# EasyEDA schematic SCH_New Project4_2022-07-20.json
TITLE: 自平衡方块; REV: 1.0; Date: 2022-07-08; Sheet: 1/1; Drawn By: xiaocainiao233; Company: 寄
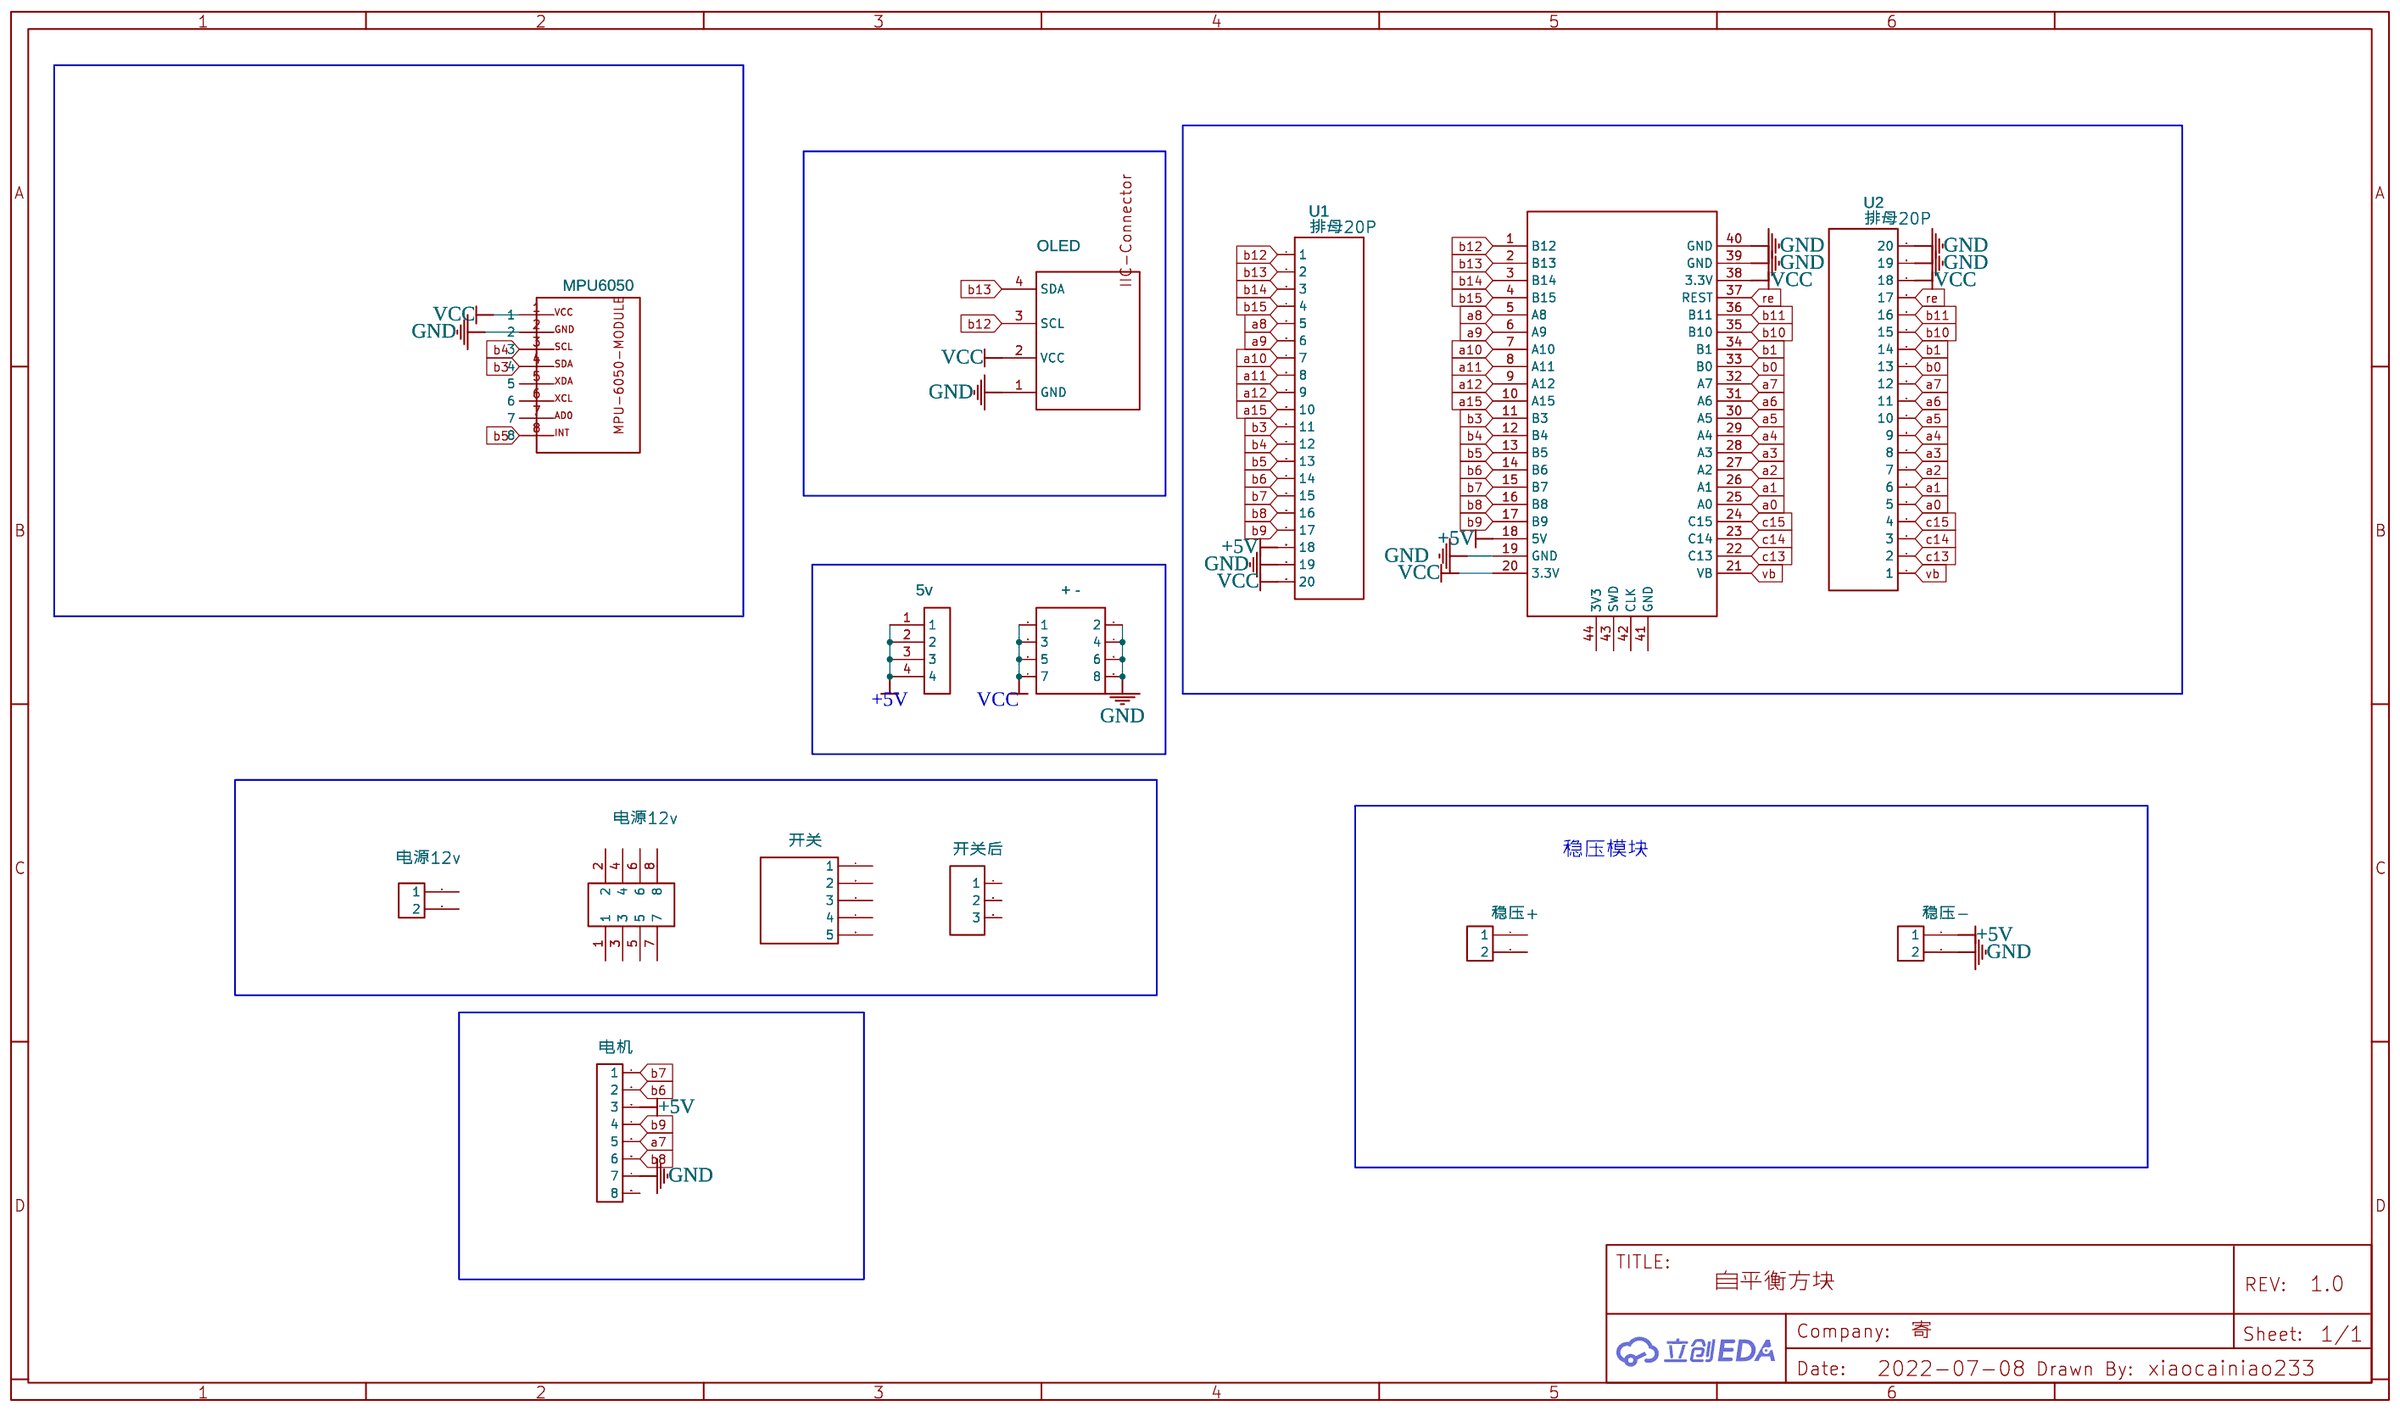
[diagram p0: schematic sheet]

## Parts
AAAAU1  MPU6050  [MPU-6050-MODULE]
ASDFGUUU1  STM32F103C8T6最小系统板  [STM32F103C8T6]
H1  + -  [HDR-TH_8P-P2.54-V-F-R2-C4-S2.54]
H2  5v  [排针排母4P 2.54MM]
H3  电源12v  [排针排母2*4P]
J1  电源12v  [排针排母2P]
J2  开关  [排针排母5P]
J3  电机  [排针排母8P]
J4  稳压+  [排针排母2P]
J5  稳压-  [排针排母2P]
J6  开关后  [排针排母3P]
OLED  0.96OLED  [0.96OLED_4P]
U1  排母20P  [HDR-TH_20P-P2.54-V]
U2  排母20P  [HDR-TH_20P-P2.54-V]

## Library data of the parts
AAAAU1 = MPU6050: Contributor: PLC_xiaobai
H1 = 2.54排母_2X4: Supplier: LCSC; Manufacturer: Ckmtw; Manufacturer Part: 220S-2*4P H=8.5MM Ytype Gold-plated; Supplier Part: C124422
H2 = 排针排母4P: Supplier Part: C169817; Manufacturer: Shenzhen Cankemeng; Contributor: puffeda
H3 = 排针排母2*4P: Supplier: LCSC; Supplier Part: C169817; Manufacturer: Shenzhen Cankemeng; Contributor: PQG2030PQG
J1 J4 J5 = 排针排母1*2P: Supplier Part: C115245; Supplier: LCSC; Contributor: 96_Yang
J2 = 排针排母1*5P: Supplier Part: C115245; Supplier: LCSC; Contributor: cssfxy
J3 = 排针排母1*8P: Supplier Part: C115245; Supplier: LCSC; Contributor: PQG2030PQG
J6 = 排针排母1*3P: Supplier: LCSC; Manufacturer Part: Headers; image: http://image.lceda.cn/szlcsc/C57369.jpg; Supplier Part: C57369; Contributor: PQG2030PQG
OLED = 0.96OLED_4P_MODULE_JX: Supplier: LCSC; Supplier Part: C9900004566; Manufacturer: null; Contributor: LCSC; JLCPCB Part Class: Extended Part
U1 U2 = 排母20P: Contributor: jack.liang

## Nets
+5V: ASDFGUUU1.18(5V) H2.1 H2.2 H2.3 H2.4 J3.3 J5.1 U1.18
GND: AAAAU1.2 ASDFGUUU1.19(GND) ASDFGUUU1.39(GND) ASDFGUUU1.40(GND) H1.2 H1.4 H1.6 H1.8 J3.7 J5.2 OLED.1(GND) U1.19 U2.19 U2.20
VCC: AAAAU1.1 ASDFGUUU1.20(3.3V) ASDFGUUU1.38(3.3V) H1.1 H1.3 H1.5 H1.7 OLED.2(VCC) U1.20 U2.18
a0: ASDFGUUU1.25(A0) U2.5
a1: ASDFGUUU1.26(A1) U2.6
a2: ASDFGUUU1.27(A2) U2.7
a3: ASDFGUUU1.28(A3) U2.8
a4: ASDFGUUU1.29(A4) U2.9
a5: ASDFGUUU1.30(A5) U2.10
a6: ASDFGUUU1.31(A6) U2.11
a7: ASDFGUUU1.32(A7) J3.5 U2.12
a8: ASDFGUUU1.5(A8) U1.5
a9: ASDFGUUU1.6(A9) U1.6
a10: ASDFGUUU1.7(A10) U1.7
a11: ASDFGUUU1.8(A11) U1.8
a12: ASDFGUUU1.9(A12) U1.9
a15: ASDFGUUU1.10(A15) U1.10
b0: ASDFGUUU1.33(B0) U2.13
b1: ASDFGUUU1.34(B1) U2.14
b3: AAAAU1.4 ASDFGUUU1.11(B3) U1.11
b4: AAAAU1.3 ASDFGUUU1.12(B4) U1.12
b5: AAAAU1.8 ASDFGUUU1.13(B5) U1.13
b6: ASDFGUUU1.14(B6) J3.2 U1.14
b7: ASDFGUUU1.15(B7) J3.1 U1.15
b8: ASDFGUUU1.16(B8) J3.6 U1.16
b9: ASDFGUUU1.17(B9) J3.4 U1.17
b10: ASDFGUUU1.35(B10) U2.15
b11: ASDFGUUU1.36(B11) U2.16
b12: ASDFGUUU1.1(B12) OLED.3(SCL) U1.1
b13: ASDFGUUU1.2(B13) OLED.4(SDA) U1.2
b14: ASDFGUUU1.3(B14) U1.3
b15: ASDFGUUU1.4(B15) U1.4
c13: ASDFGUUU1.22(C13) U2.2
c14: ASDFGUUU1.23(C14) U2.3
c15: ASDFGUUU1.24(C15) U2.4
re: ASDFGUUU1.37(REST) U2.17
vb: ASDFGUUU1.21(VB) U2.1

Not connected (* = marked no-connect by the designer): AAAAU1 5 6 7; ASDFGUUU1 41(GND) 42(CLK) 43(SWD) 44(3V3); H3 1 2 3 4 5 6 7 8; J1 1 2; J2 1 2 3 4 5; J3 8; J4 1 2; J6 1 2 3

## Notes on the sheet
- 稳压模块
